# Altium schematic sheet Power_driver_MCU.SchDoc
size 420 x 297 mm; Scale: 1:1; DocumentType: Схема электрическая принципиальная; FirstReferrence: АБВГ.123456.001
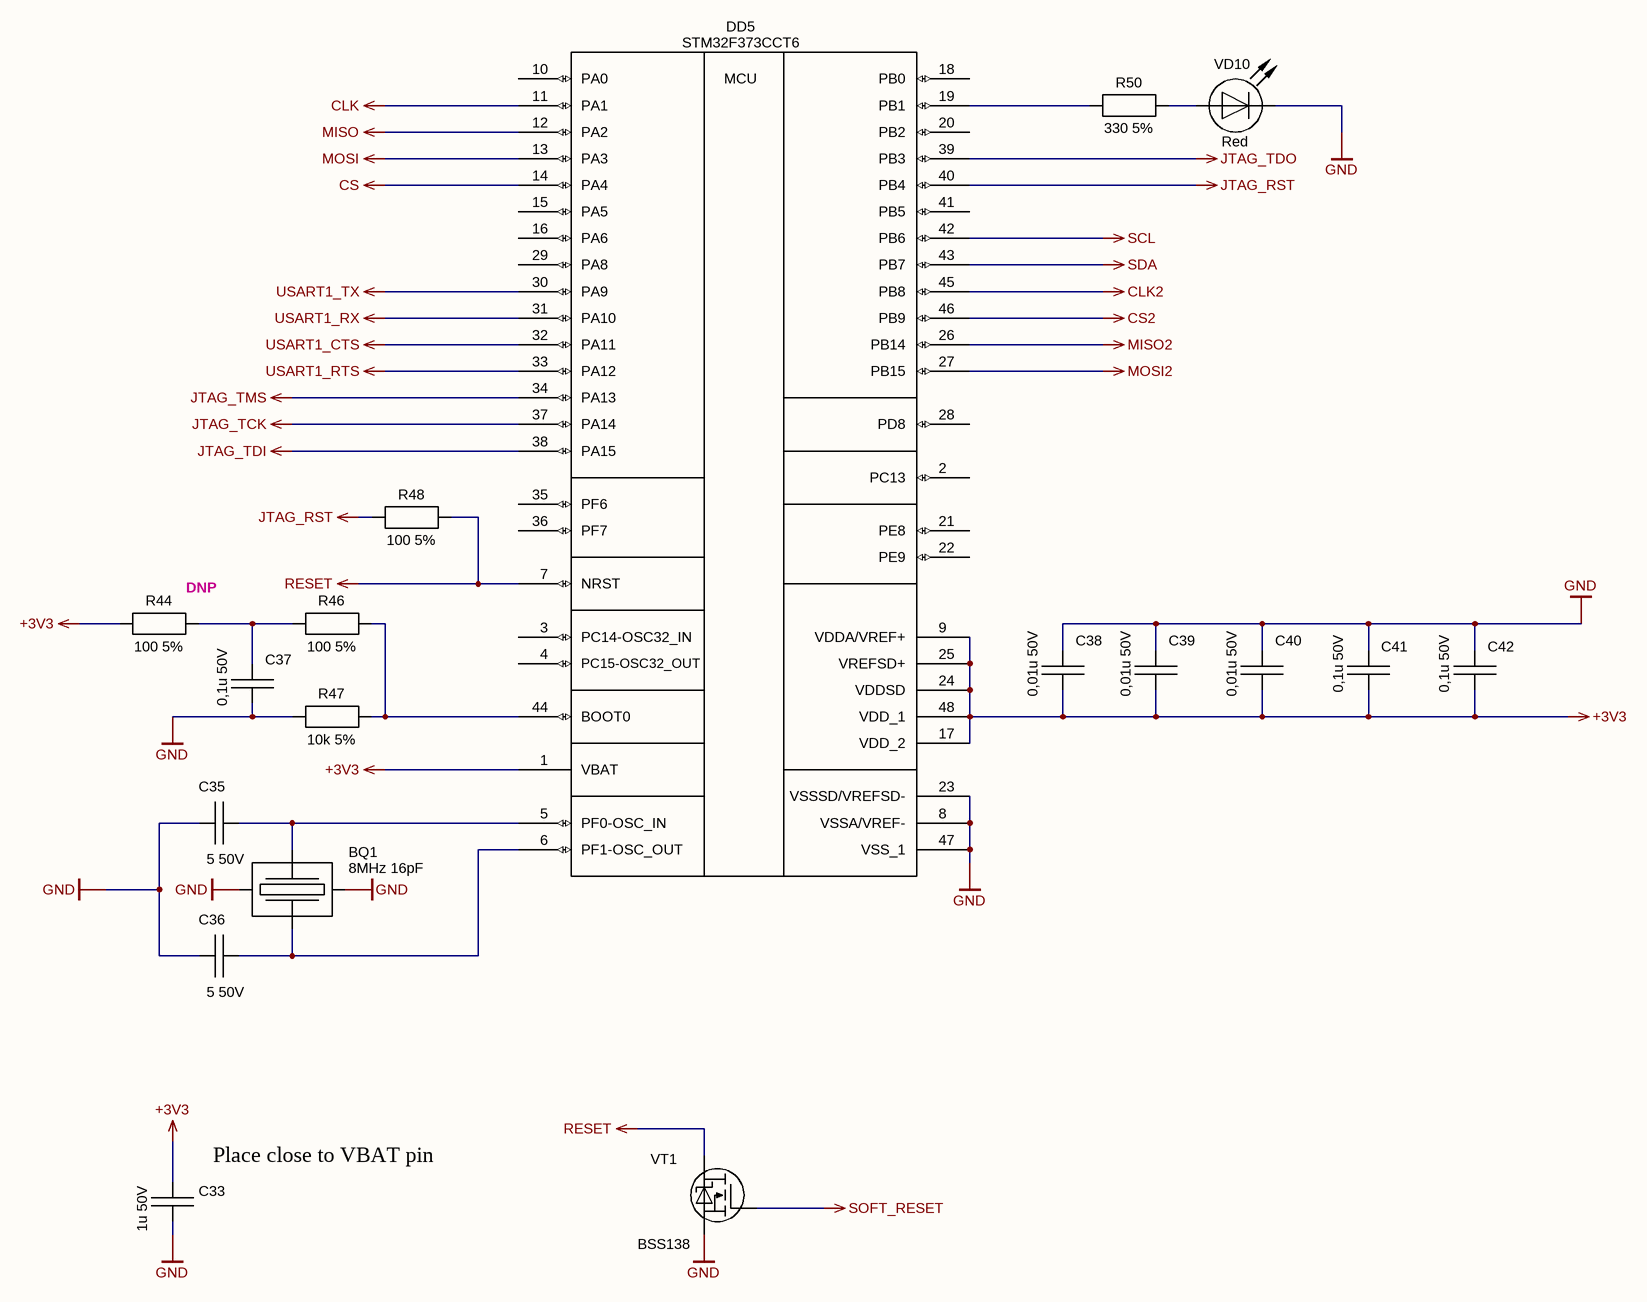
[diagram p0: Power_driver_MCU.SchDoc]

## Parts
BQ1  8MHz 16pF  [Crystal_50x32x110]
C33  1u 50V  [C0603_CAPC1608X09N]
C35  5 50V  [C0603_CAPC1608X09N]
C36  5 50V  [C0603_CAPC1608X09N]
C37  0,1u 50V  [C0603_CAPC1608X09N]
C38  0,01u 50V  [C0603_CAPC1608X09N]
C39  0,01u 50V  [C0603_CAPC1608X09N]
C40  0,01u 50V  [C0603_CAPC1608X09N]
C41  0,1u 50V  [C0603_CAPC1608X09N]
C42  0,1u 50V  [C0603_CAPC1608X09N]
DD5  STM32F373CCT6  [LQFP48_TSQFP50P900X900X160-48L]
R44  100 5%  Staff: DNP  [R0603_RESC1608X06N]
R46  100 5%  [R0603_RESC1608X06N]
R47  10k 5%  [R0603_RESC1608X06N]
R48  100 5%  [R0603_RESC1608X06N]
R50  330 5%  [R0603_RESC1608X06N]
VD10  Red  [LED_0603]
VT1  BSS138  [SOT23_SOT95P237X110-3M]

## Nets
+3V3: C33.2 C38.2 C39.2 C40.2 C41.2 C42.2 DD5.1(VBAT) DD5.9(VDDA/VREF+) DD5.17(VDD_2) DD5.24(VDDSD) DD5.25(VREFSD+) DD5.48(VDD_1) R44.1
CLK: DD5.11(PA1)
CLK2: DD5.45(PB8)
CS: DD5.14(PA4)
CS2: DD5.46(PB9)
GND: BQ1.2 BQ1.4 C33.1 C35.1 C36.1 C37.2 C38.1 C39.1 C40.1 C41.1 C42.1 DD5.8(VSSA/VREF-) DD5.23(VSSSD/VREFSD-) DD5.47(VSS_1) R47.1 VD10.1(K) VT1.2(S)
JTAG_RST: DD5.40(PB4) R48.1
JTAG_TCK: DD5.37(PA14)
JTAG_TDI: DD5.38(PA15)
JTAG_TDO: DD5.39(PB3)
JTAG_TMS: DD5.34(PA13)
MISO: DD5.12(PA2)
MISO2: DD5.26(PB14)
MOSI: DD5.13(PA3)
MOSI2: DD5.27(PB15)
RESET: DD5.7(NRST) R48.2 VT1.3(D)
SCL: DD5.42(PB6)
SDA: DD5.43(PB7)
SOFT_RESET: VT1.1(G)
USART1_CTS: DD5.32(PA11)
USART1_RTS: DD5.33(PA12)
USART1_RX: DD5.31(PA10)
USART1_TX: DD5.30(PA9)
NetBQ1_1: BQ1.1 C36.2 DD5.6(PF1-OSC_OUT)
NetBQ1_3: BQ1.3 C35.2 DD5.5(PF0-OSC_IN)
NetC37_1: C37.1 R44.2 R46.1
NetDD5_19: DD5.19(PB1) R50.1
NetDD5_44: DD5.44(BOOT0) R46.2 R47.2
NetR50_2: R50.2 VD10.2(A)

Not connected (* = marked no-connect by the designer): DD5 2(PC13) 3(PC14-OSC32_IN) 4(PC15-OSC32_OUT) 10(PA0) 15(PA5) 16(PA6) 18(PB0) 20(PB2) 21(PE8) 22(PE9) 28(PD8) 29(PA8) 35(PF6) 36(PF7) 41(PB5)

## Notes on the sheet
- (near C33) Place close to VBAT pin
- Подп. и дата
- Инв. № дубл.
- Взам. инв. №
- Инв. № подл.
- Изм.
- Лист
- № докум.
- Подп.
- Дата
- 2.106-A3
- Копировал
- Формат А3
- (in symbol STM32F373CCT6) MCU

## Library data of the parts
BQ1 = KX-9A 8.0 MHz: Резонатор кварцевый 8 МГц, 50 ppm, 16 пФ, 5,0 x 3,2mm, SMT; Manufacturer: Geyer; ModelSTEP: Z:\LIB\ALTIUM\MODEL\STEP\Crystal\Crystal_smd_52x34x1.step; Designer: Pashinskiy; EOL: NO; PartNumber: KX-9A 8.0 MHz; ValueBOM: KX-9A 8.0 MHz; ValueSCH: 8MHz 16pF; Mount: SMT; HelpURL: Z:\LIB\ALTIUM\INFO\Crystal\GEYER-KX-9A_Series.pdf; Modify: 24.11.2016
C33 = CC0603KRX7R9BB105: Конденсатор керамический (MLCC) общего назначения 0603; Manufacturer: YAGEO; ValueBOM: 1мкФ ±10% 50В X7R 0603; ModelSTEP: Z:\LIB\ALTIUM\MODEL\STEP\Capacitor\C0603_CAPC1608X09.Step; Designer: Dudarev; EOL: NO; PartNumber: CC0603KRX7R9BB105; ValueSCH: 1u 50V; Mount: SMT; HelpURL: Z:\LIB\ALTIUM\INFO\Capacitor\UPY-GPHC_X7R_6.3V-to-50V_13.pdf; Modify: 28.06.2016
C35 C36 = CC0603CRNPO9BN5R0: Конденсатор керамический (MLCC) общего назначения 0603; Manufacturer: YAGEO; ValueBOM: 5пФ ±0,25пФ 50В NP0 0603; ModelSTEP: Z:\LIB\ALTIUM\MODEL\STEP\Capacitor\C0603_CAPC1608X09.Step; Designer: Pashinskiy; EOL: NO; PartNumber: CC0603CRNPO9BN5R0; ValueSCH: 5 50V; Mount: SMT; HelpURL: Z:\LIB\ALTIUM\INFO\Capacitor\UPY-GP_NP0_16V-to-50V_14.pdf; Modify: 19.08.2016
C37 C41 C42 = CC0603KRX7R9BB104: Конденсатор керамический (MLCC) общего назначения 0603; Manufacturer: YAGEO; ValueBOM: 0,1мкФ ±10% 50В X7R 0603; ModelSTEP: Z:\LIB\ALTIUM\MODEL\STEP\Capacitor\C0603_CAPC1608X09.Step; Designer: Dudarev; EOL: NO; PartNumber: CC0603KRX7R9BB104; ValueSCH: 0,1u 50V; Mount: SMT; HelpURL: Z:\LIB\ALTIUM\INFO\Capacitor\UPY-GPHC_X7R_6.3V-to-50V_13.pdf; Modify: 28.06.2016
C38-C40 = CC0603KRX7R9BB103: Конденсатор керамический (MLCC) общего назначения 0603; Manufacturer: YAGEO; ValueBOM: 0,01мкФ ±10% 50В X7R 0603; ModelSTEP: Z:\LIB\ALTIUM\MODEL\STEP\Capacitor\C0603_CAPC1608X09.Step; Designer: Dudarev; EOL: NO; PartNumber: CC0603KRX7R9BB103; ValueSCH: 0,01u 50V; Mount: SMT; HelpURL: Z:\LIB\ALTIUM\INFO\Capacitor\UPY-GPHC_X7R_6.3V-to-50V_13.pdf; Modify: 28.06.2016
DD5 = STM32F373CCT6: Microcontroller ARM Cortex-M4, 32b, MCU+FPU, 1,25DMIPS, 256 kB Flash, 32kB SRAM, USB, LQFP48
R44 R46 R48 = RC0603JR-07100RL: Резистор толстопленочный общего назначения 0603; Manufacturer: YAGEO; ValueBOM: 100Ом 5% 75В 200ppm 0603; ModelSTEP: Z:\LIB\ALTIUM\MODEL\STEP\Resistor\R0603_RESC1005X04.step; Designer: Dudarev; EOL: NO; PartNumber: RC0603JR-07100RL; ValueSCH: 100 5%; Mount: SMT; HelpURL: Z:\LIB\ALTIUM\INFO\Resistor\YAGEO\Lead free chip resistors RC_P.pdf; Modify: 28.06.2016
R47 = RC0603JR-0710KL: Резистор толстопленочный общего назначения 0603; Manufacturer: YAGEO; ValueBOM: 10кОм 5% 75В 150ppm 0603; ModelSTEP: Z:\LIB\ALTIUM\MODEL\STEP\Resistor\R0603_RESC1005X04.step; Designer: Dudarev; EOL: NO; PartNumber: RC0603JR-0710KL; ValueSCH: 10k 5%; Mount: SMT; HelpURL: Z:\LIB\ALTIUM\INFO\Resistor\YAGEO\Lead free chip resistors RC_P.pdf; Modify: 28.06.2016
R50 = RC0603JR-07330RL: Резистор толстопленочный общего назначения 0603; Manufacturer: YAGEO; ValueBOM: 330Ом 5% 75В 150ppm 0603; ModelSTEP: Z:\LIB\ALTIUM\MODEL\STEP\Resistor\R0603_RESC1005X04.step; Designer: Dudarev; EOL: NO; PartNumber: RC0603JR-07330RL; ValueSCH: 330 5%; Mount: SMT; HelpURL: Z:\LIB\ALTIUM\INFO\Resistor\YAGEO\Lead free chip resistors RC_P.pdf; Modify: 28.06.2016
VD10 = VLMS1300-GS08: LED SMD Super Red 1,6mm x 0,8mm; Manufacturer: Vishay Semiconductors; ModelSTEP: Z:\LIB\ALTIUM\MODEL\STEP\LED\User Library-LED_0603_R.STEP; Designer: Losev; EOL: NO; PartNumber: VLMS1300-GS08; ValueBOM: VLMS1300-GS08; ValueSCH: Red; Mount: SMT; HelpURL: Z:\LIB\ALTIUM\INFO\LED\vlmo1300-241412.pdf; Modify: 11.11.2016
VT1 = N-MOSFET: N-Channel MOSFET transistor Logic level